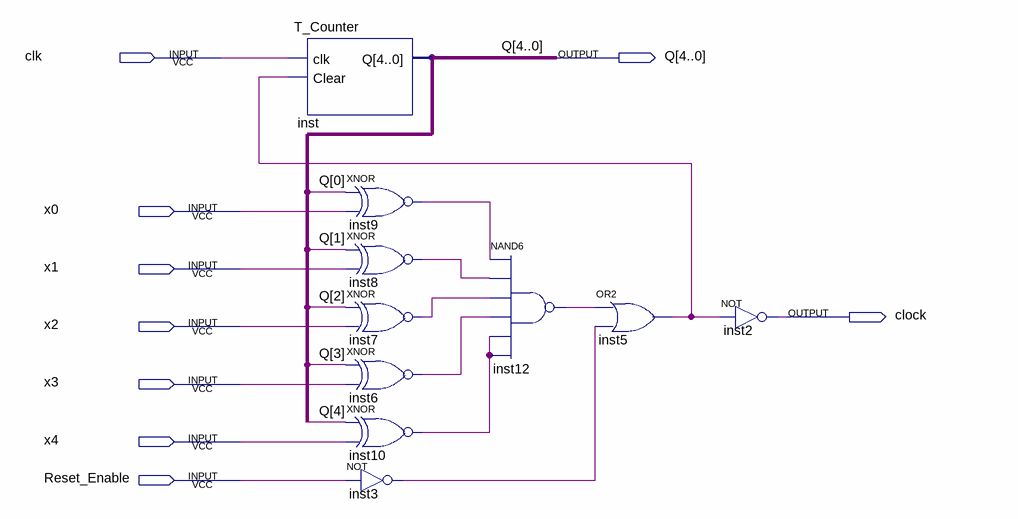
[diagram p0: schematic sheet]
// Quartus schematic CNT_with_score_coef.bdf as structural Verilog: 10 symbols, 9 pins
module CNT_with_score_coef (
  input  clk,
  input  x0,
  input  x1,
  input  x2,
  input  x3,
  input  x4,
  input  Reset_Enable,
  output [4:0] Q,
  output clock
);

  wire inst3_out, inst5_out, inst6_out, inst7_out, inst8_out, inst9_out, inst10_out, inst12_out;

  T_Counter inst (.clk(clk), .Clear(inst5_out), .Q(Q));
  xnor inst9 (inst9_out, Q[0], x0);
  xnor inst8 (inst8_out, Q[1], x1);
  xnor inst7 (inst7_out, Q[2], x2);
  xnor inst6 (inst6_out, Q[3], x3);
  xnor inst10 (inst10_out, Q[4], x4);
  not inst3 (inst3_out, Reset_Enable);
  nand inst12 (inst12_out, inst9_out, inst8_out, inst7_out, inst6_out, inst10_out, inst10_out);
  or inst5 (inst5_out, inst12_out, inst3_out);
  not inst2 (clock, inst5_out);
endmodule
